# Altium schematic sheet Sheet1.schdoc
size A
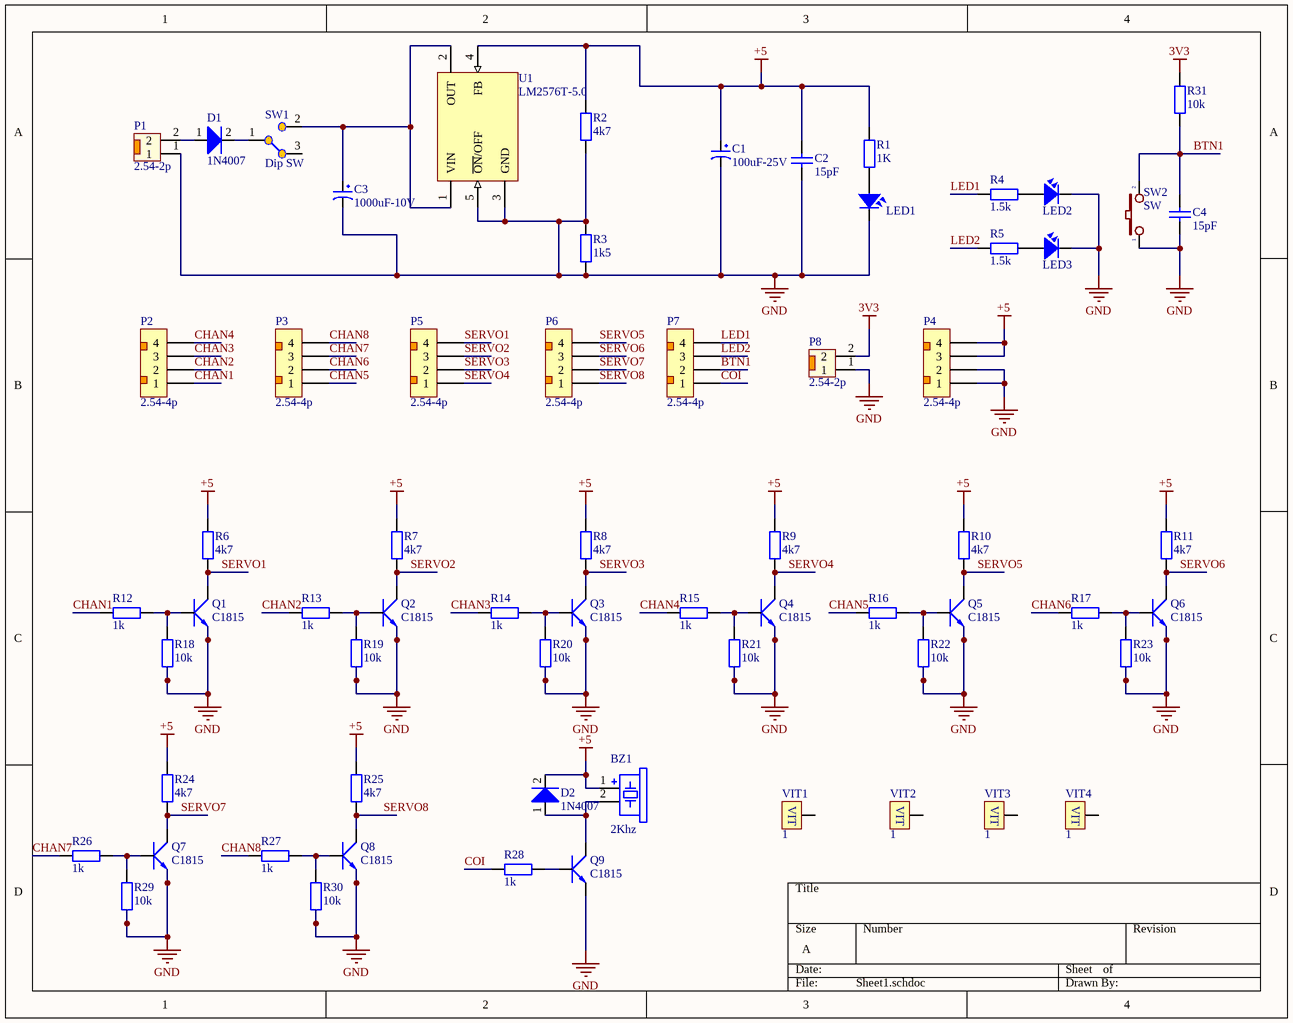
[diagram p0: Sheet1.schdoc]

## Parts
BZ1  2Khz  [coi xung]
C1  100uF-25V  [tu hoa 5mm]
C2  15pF  [tu gom]
C3  1000uF-10V  [tu hoa 10mm]
C4  15pF  [tu gom]
D1  1N4007  [1N4007]
D2  1N4007  [1N4007]
LED1  LED  [LED-3]  (value not drawn)
LED2  LED  [LED-3]  (value not drawn)
LED3  LED  [LED-3]  (value not drawn)
P1  2.54-2p  [Header Duc Thang 2P 2.54]
P2  2.54-4p  [Header Duc Thang 4p 2.54]
P3  2.54-4p  [Header Duc Thang 4p 2.54]
P4  2.54-4p  [Header Duc Thang 4p 2.54]
P5  2.54-4p  [Header Duc Thang 4p 2.54]
P6  2.54-4p  [Header Duc Thang 4p 2.54]
P7  2.54-4p  [Header Duc Thang 4p 2.54]
P8  2.54-2p  [Header Duc Thang 2P 2.54]
Q1  C1815  [QTO-92]
Q2  C1815  [QTO-92]
Q3  C1815  [QTO-92]
Q4  C1815  [QTO-92]
Q5  C1815  [QTO-92]
Q6  C1815  [QTO-92]
Q7  C1815  [QTO-92]
Q8  C1815  [QTO-92]
Q9  C1815  [QTO-92]
R1  1K  [tro vach 1/4w]
R2  4k7  [tro vach 1/4w]
R3  1k5  [tro vach 1/4w]
R4  1.5k  [tro vach 1/4w]
R5  1.5k  [tro vach 1/4w]
R6  4k7  [tro vach 1/4w]
R7  4k7  [tro vach 1/4w]
R8  4k7  [tro vach 1/4w]
R9  4k7  [tro vach 1/4w]
R10  4k7  [tro vach 1/4w]
R11  4k7  [tro vach 1/4w]
R12  1k  [tro vach 1/4w]
R13  1k  [tro vach 1/4w]
R14  1k  [tro vach 1/4w]
R15  1k  [tro vach 1/4w]
R16  1k  [tro vach 1/4w]
R17  1k  [tro vach 1/4w]
R18  10k  [tro vach 1/4w]
R19  10k  [tro vach 1/4w]
R20  10k  [tro vach 1/4w]
R21  10k  [tro vach 1/4w]
R22  10k  [tro vach 1/4w]
R23  10k  [tro vach 1/4w]
R24  4k7  [tro vach 1/4w]
R25  4k7  [tro vach 1/4w]
R26  1k  [tro vach 1/4w]
R27  1k  [tro vach 1/4w]
R28  1k  [tro vach 1/4w]
R29  10k  [tro vach 1/4w]
R30  10k  [tro vach 1/4w]
R31  10k  [tro vach 1/4w]
SW1  Dip SW  [SW3P]
SW2  SW  [SW2]
U1  LM2576T-5.0  [LM2576t]
VIT1  1  [VIT]
VIT2  1  [VIT]
VIT3  1  [VIT]
VIT4  1  [VIT]

## Nets
3V3: P8.2 R31.2
+5: BZ1.1 C1.1 C2.1 D2.2(K) P4.3 P4.4 R1.2 R2.2 R6.2 R7.2 R8.2 R9.2 R10.2 R11.2 R24.2 R25.2 U1.4(FB)
GND: C1.2 C2.2 C3.2 C4.2 LED1.2 LED2.2 LED3.2 P1.1 P4.1 P4.2 P8.1 Q1.1(E) Q2.1(E) Q3.1(E) Q4.1(E) Q5.1(E) Q6.1(E) Q7.1(E) Q8.1(E) Q9.1(E) R2.1 R3.1 R3.2 R18.1 R19.1 R20.1 R21.1 R22.1 R23.1 R29.1 R30.1 SW2.1 U1.3(GND) U1.5(~{ON}/OFF)
BTN1: C4.1 P7.2 R31.1 SW2.2
CHAN1: P2.1 R12.1
CHAN2: P2.2 R13.1
CHAN3: P2.3 R14.1
CHAN4: P2.4 R15.1
CHAN5: P3.1 R16.1
CHAN6: P3.2 R17.1
CHAN7: P3.3 R26.1
CHAN8: P3.4 R27.1
COI: P7.1 R28.1
LED1: P7.4 R4.2
LED2: P7.3 R5.2
SERVO1: P5.4 Q1.2(C) R6.1
SERVO2: P5.3 Q2.2(C) R7.1
SERVO3: P5.2 Q3.2(C) R8.1
SERVO4: P5.1 Q4.2(C) R9.1
SERVO5: P6.4 Q5.2(C) R10.1
SERVO6: P6.3 Q6.2(C) R11.1
SERVO7: P6.2 Q7.2(C) R24.1
SERVO8: P6.1 Q8.2(C) R25.1
NetBZ1_2: BZ1.2 D2.1(A) Q9.2(C)
NetC3_1: C3.1 SW1.2(NC) U1.1(VIN) U1.2(OUT)
NetD1_1: D1.1(A) P1.2
NetD1_2: D1.2(K) SW1.1(COM)
NetLED1_1: LED1.1 R1.1
NetLED2_1: LED2.1 R4.1
NetLED3_1: LED3.1 R5.1
NetQ1_3: Q1.3(B) R12.2 R18.2
NetQ2_3: Q2.3(B) R13.2 R19.2
NetQ3_3: Q3.3(B) R14.2 R20.2
NetQ4_3: Q4.3(B) R15.2 R21.2
NetQ5_3: Q5.3(B) R16.2 R22.2
NetQ6_3: Q6.3(B) R17.2 R23.2
NetQ7_3: Q7.3(B) R26.2 R29.2
NetQ8_3: Q8.3(B) R27.2 R30.2
NetQ9_3: Q9.3(B) R28.2

Not connected (* = marked no-connect by the designer): SW1 3(NO); VIT1 VIT1(1); VIT2 VIT1(1); VIT3 VIT1(1); VIT4 VIT1(1)

## Library data of the parts
BZ1 = Coi xung 2Khz: Cắm; Don_Vi: Con; Ma_Hang: MH007704; Ten_Linh_Kien: Còi Xung 8.5x12MM 16R 2Khz 3-12V; Chung_Loai: Cắm
C1 = Tu Hoa 100uF 25V 6x11: Cắm; Don_Vi: Con; So_Chan: 2; Ten_Linh_Kien: Tụ Hóa 100uF 25V 6x11MM; Ma_Hang: MH001351; Chung_Loai: Cắm; Kieu_Chan: *
C2 C4 = Tu gom 15pF 50V: Cắm; Don_Vi: Con; So_Chan: 2; Ten_Linh_Kien: Tụ gốm 15P 50V; Ma_Hang: MH004767; Chung_Loai: Cắm; Kieu_Chan: *
C3 = Tu Hoa 1000uF 10V 10x12: Cắm; So_Chan: 2; Don_Vi: Con; Ten_Linh_Kien: Tụ Hóa 1000uF 10V 10x12MM; Ma_Hang: MH006614; Kieu_Chan: *; Chung_Loai: Cắm
D1 D2 = 1N4007: Diode LS 1A 1000V DO-41; ComponentLink1Description: Datasheet; ComponentLink1URL: D:\Dropbox\Datasheets\Diodes and Rectifiers\Diodes\1N400X.pdf; Unit Price: 0.0072
LED1-LED3 = LED: LED Single colour Green and Red; Value: LED 3 ly Single Colour
P1 P8 = Header 2.54-2p Duc Thang: Cắm; So_Chan: 2; Don_Vi: Con; Ten_Linh_Kien: Header 2P XH2.54-2P Đực Thẳng; Ma_Hang: MH001283; Chung_Loai: Cắm; Kieu_Chan: *
P2-P7 = Header 2.54_4p Duc Thang: Cắm; Don_Vi: Con; So_Chan: 4; Ten_Linh_Kien: Header 4P XH2.54-4P Đực Thẳng; Ma_Hang: MH001285; Chung_Loai: Cắm; Kieu_Chan: *
Q1-Q9 = C1815: NPN 600mW, ECB; Value: C1815
R1-R31 = Tro Vach 1/4W 5% 1.5k: Cắm; Don_Vi: Con; So_Chan: 2; Ten_Linh_Kien: Trở Vạch 1/4w 5% 1.5k; Ma_Hang: MH007284; Chung_Loai: Cắm; Kieu_Chan: *
SW1 = Switch3P: Dip Switch 3 pin
SW2 = SW2: Switch button 2 pin; Value: SW chip 2 pin
U1 = LM2576T-5.0: SIMPLE SWITCHER; 3A Step-Down Voltage Regulator; Manufacturer: National Semiconductor; PackageTopMarking: NSUZXYTT*LM2576T*-5.0 P+; PowerWise: N; FirstPublished: 4-Dec-2008; DatasheetVersion: Aug-2004; PackageVersion: revJ, Jan-1992; PackageReference: T05A; Publisher: Altium Limited; PackageDescription: TO-220, Molded, 5 Lead, Straight; CompType: Switcher; PartNumber: LM2576T-5.0; RoHS: O; PinCount: 5; DigiKeyPartNumber: LM2576T-5.0-ND; Code_JEDEC: TO-220-AB; ComponentLink1Description: LM2576 Datasheet; ComponentLink1URL: http://www.national.com/ds/LM/LM2576.pdf; ComponentLink2Description: LM2576 Web Page; ComponentLink2URL: http://www.national.com/pf/LM/LM2576.html; ComponentLink3Description: T05A Package Page; ComponentLink3URL: http://www.national.com/packaging/folders/t05a.html
VIT1-VIT4 = VIT: Oc Vit